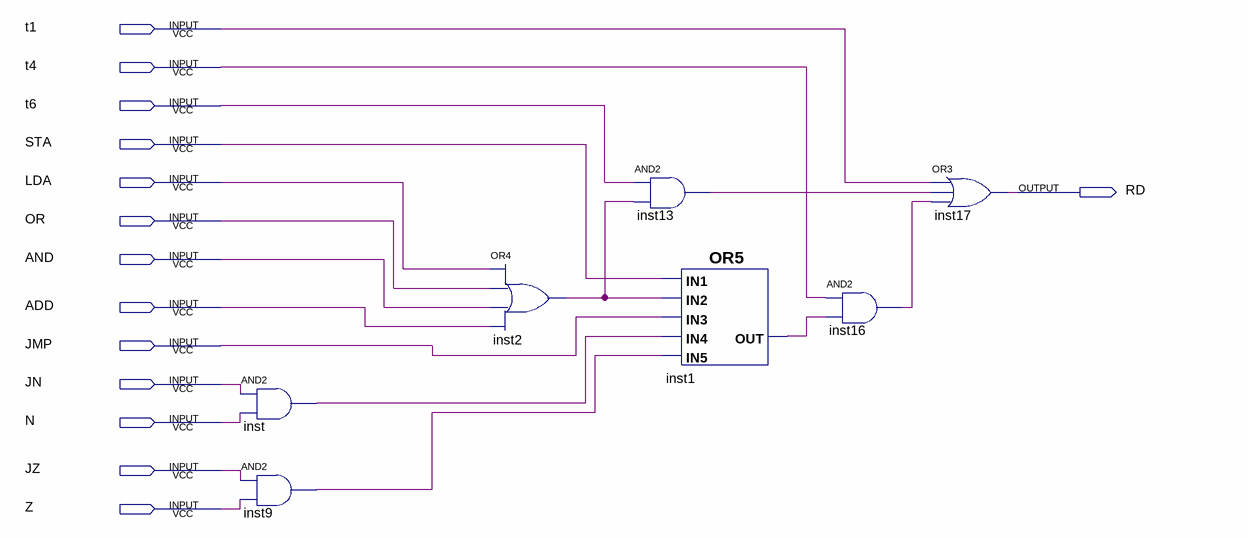
[diagram p0: schematic sheet]
// Quartus schematic Read.bdf as structural Verilog: 7 symbols, 14 pins
module Read (
  input  t1,
  input  t4,
  input  t6,
  input  STA,
  input  LDA,
  input  OR,
  input  AND,
  input  ADD,
  input  JMP,
  input  JN,
  input  N,
  input  JZ,
  input  Z,
  output RD
);

  wire inst1_out, inst2_out, inst9_out, inst13_out, inst16_out, inst_out;

  and inst (inst_out, JN, N);
  and inst9 (inst9_out, JZ, Z);
  or inst2 (inst2_out, LDA, OR, AND, ADD);
  and inst13 (inst13_out, t6, inst2_out);
  or inst1 (inst1_out, STA, inst2_out, JMP, inst_out, inst9_out);
  and inst16 (inst16_out, t4, inst1_out);
  or inst17 (RD, t1, inst13_out, inst16_out);
endmodule
